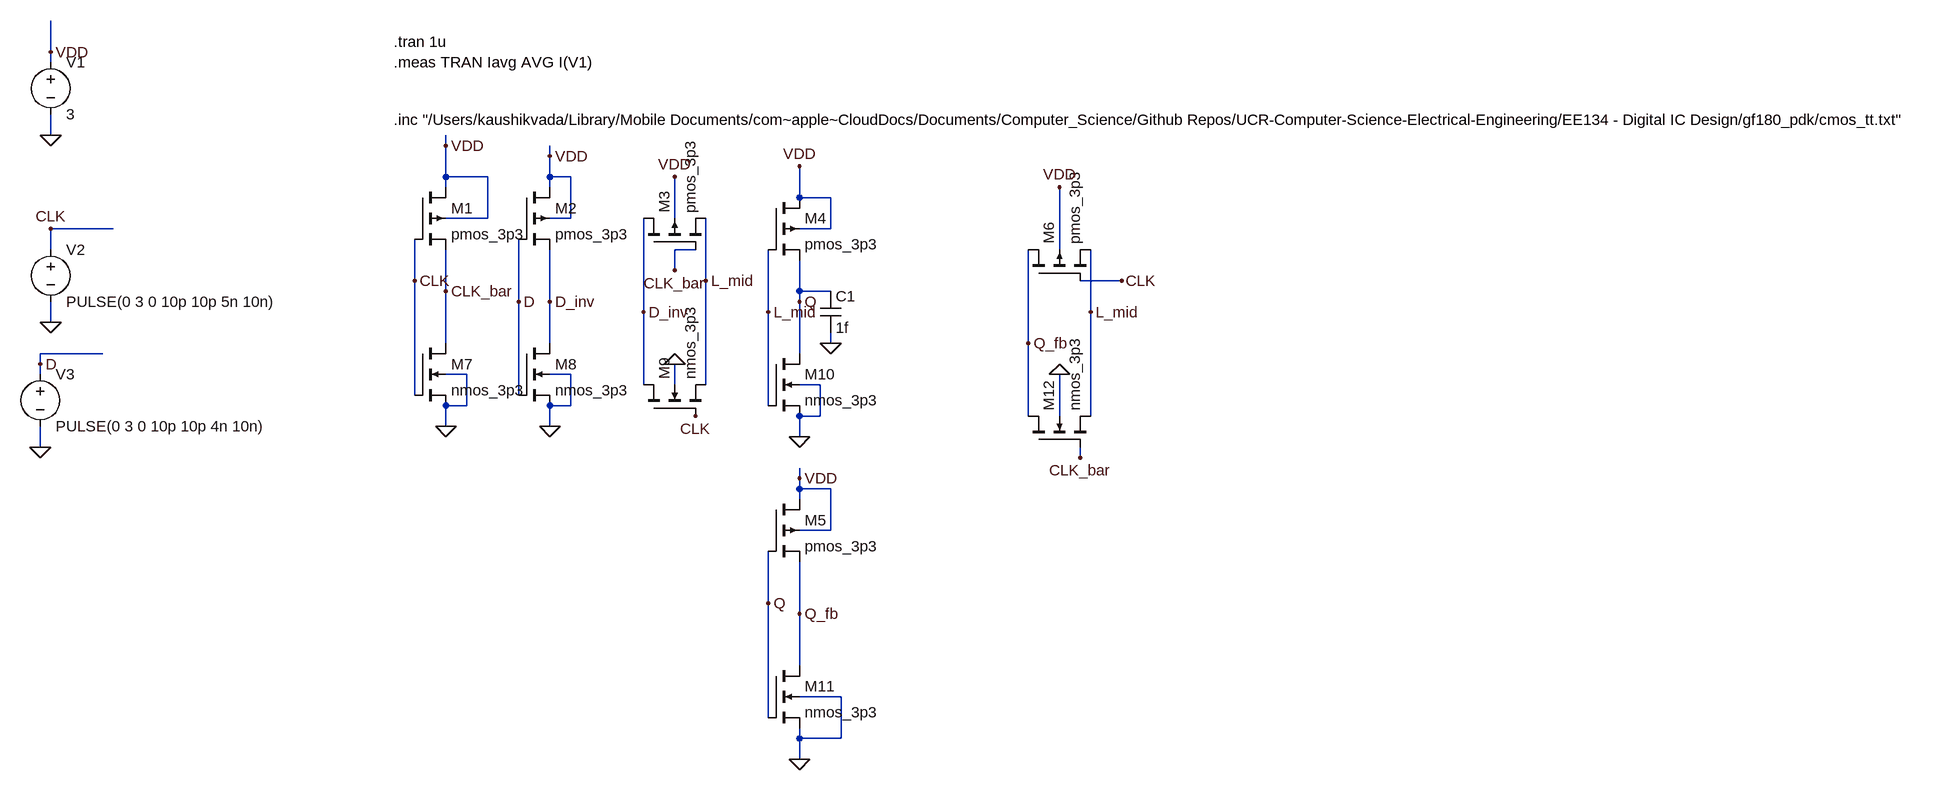
[diagram p0: schematic Q3_4.asc]
Q3_4.asc, the LTspice schematic file:
Version 4
SHEET 1 2116 992
WIRE -768 -112 -768 -160
WIRE -768 -96 -768 -112
WIRE -768 16 -768 -16
WIRE -160 32 -160 16
WIRE 0 48 0 32
WIRE -160 80 -160 32
WIRE -96 80 -160 80
WIRE 0 80 0 48
WIRE 32 80 0 80
WIRE -160 96 -160 80
WIRE 0 96 0 80
WIRE 384 112 384 64
WIRE 432 112 384 112
WIRE -96 144 -96 80
WIRE -96 144 -160 144
WIRE 32 144 32 80
WIRE 32 144 0 144
WIRE 192 144 192 80
WIRE -672 160 -768 160
WIRE 432 160 432 112
WIRE 432 160 384 160
WIRE -768 192 -768 160
WIRE 224 192 192 192
WIRE 784 192 784 96
WIRE 192 224 192 192
WIRE -208 240 -208 176
WIRE 240 240 240 144
WIRE 880 240 816 240
WIRE -160 256 -160 192
WIRE 384 256 384 208
WIRE 432 256 384 256
WIRE -48 272 -48 176
WIRE 0 272 0 192
WIRE 384 272 384 256
WIRE 144 288 144 144
WIRE 336 288 336 192
WIRE 832 288 832 192
WIRE -768 304 -768 272
WIRE -160 336 -160 256
WIRE 0 336 0 272
WIRE 432 336 432 320
WIRE 736 336 736 192
WIRE -688 352 -784 352
WIRE 384 352 384 272
WIRE -784 368 -784 352
WIRE -784 384 -784 368
WIRE -128 384 -160 384
WIRE 32 384 0 384
WIRE 144 400 144 288
WIRE 192 400 192 368
WIRE 240 400 240 240
WIRE 416 400 384 400
WIRE -208 416 -208 240
WIRE -48 416 -48 272
WIRE -128 432 -128 384
WIRE -128 432 -160 432
WIRE 32 432 32 384
WIRE 32 432 0 432
WIRE 336 432 336 288
WIRE 416 448 416 400
WIRE 416 448 384 448
WIRE 736 448 736 336
WIRE 784 448 784 384
WIRE 832 448 832 288
WIRE -160 464 -160 432
WIRE 0 464 0 432
WIRE 384 480 384 448
WIRE -784 496 -784 464
WIRE 816 512 816 496
WIRE 384 544 384 528
WIRE 384 560 384 544
WIRE 432 560 384 560
WIRE 384 576 384 560
WIRE 432 624 432 560
WIRE 432 624 384 624
WIRE 336 736 336 656
WIRE 384 752 384 672
WIRE 384 832 384 752
WIRE 448 880 384 880
WIRE 336 912 336 736
WIRE 384 944 384 928
WIRE 448 944 448 880
WIRE 448 944 384 944
WIRE 384 976 384 944
FLAG -768 16 0
FLAG -768 304 0
FLAG -784 496 0
FLAG -768 -112 VDD
FLAG -768 160 CLK
FLAG -784 368 D
FLAG -160 464 0
FLAG -160 256 CLK_bar
FLAG -208 240 CLK
FLAG -160 32 VDD
FLAG 0 48 VDD
FLAG 0 464 0
FLAG 0 272 D_inv
FLAG -48 272 D
FLAG 144 288 D_inv
FLAG 240 240 L_mid
FLAG 192 80 VDD
FLAG 192 224 CLK_bar
FLAG 224 448 CLK
FLAG 192 368 0
FLAG 384 64 VDD
FLAG 384 480 0
FLAG 336 288 L_mid
FLAG 384 272 Q
FLAG 432 336 0
FLAG 384 544 VDD
FLAG 384 976 0
FLAG 336 736 Q
FLAG 384 752 Q_fb
FLAG 736 336 Q_fb
FLAG 832 288 L_mid
FLAG 784 96 VDD
FLAG 784 384 0
FLAG 880 240 CLK
FLAG 816 512 CLK_bar
SYMBOL pmos4 -208 96 R0
SYMATTR InstName M1
SYMATTR Value pmos_3p3
SYMATTR Value2 l=1u w=8u
SYMBOL pmos4 -48 96 R0
SYMATTR InstName M2
SYMATTR Value pmos_3p3
SYMATTR Value2 l=1u w=8u
SYMBOL pmos4 144 192 R270
SYMATTR InstName M3
SYMATTR Value pmos_3p3
SYMATTR Value2 l=1u w=8u
SYMBOL pmos4 336 112 R0
SYMATTR InstName M4
SYMATTR Value pmos_3p3
SYMATTR Value2 l=1u w=8u
SYMBOL pmos4 336 576 R0
SYMATTR InstName M5
SYMATTR Value pmos_3p3
SYMATTR Value2 l=1u w=8u
SYMBOL pmos4 736 240 R270
SYMATTR InstName M6
SYMATTR Value pmos_3p3
SYMATTR Value2 l=1u w=8u
SYMBOL nmos4 -208 336 R0
SYMATTR InstName M7
SYMATTR Value nmos_3p3
SYMATTR Value2 l=1u w=4u
SYMBOL nmos4 -48 336 R0
SYMATTR InstName M8
SYMATTR Value nmos_3p3
SYMATTR Value2 l=1u w=4u
SYMBOL nmos4 144 448 R270
SYMATTR InstName M9
SYMATTR Value nmos_3p3
SYMATTR Value2 l=1u w=4u
SYMBOL nmos4 336 352 R0
SYMATTR InstName M10
SYMATTR Value nmos_3p3
SYMATTR Value2 l=1u w=4u
SYMBOL nmos4 336 832 R0
SYMATTR InstName M11
SYMATTR Value nmos_3p3
SYMATTR Value2 l=1u w=4u
SYMBOL nmos4 736 496 R270
SYMATTR InstName M12
SYMATTR Value nmos_3p3
SYMATTR Value2 l=1u w=4u
SYMBOL voltage -768 -112 R0
SYMATTR InstName V1
SYMATTR Value 3
SYMBOL voltage -768 176 R0
SYMATTR InstName V2
SYMATTR Value PULSE(0 3 0 10p 10p 5n 10n)
SYMBOL voltage -784 368 R0
SYMATTR InstName V3
SYMATTR Value PULSE(0 3 0 10p 10p 4n 10n)
SYMBOL cap 416 256 R0
SYMATTR InstName C1
SYMATTR Value 1f
TEXT -240 -8 Left 2 !.inc "/Users/kaushikvada/Library/Mobile Documents/com~apple~CloudDocs/Documents/Computer_Science/Github Repos/UCR-Computer-Science-Electrical-Engineering/EE134 - Digital IC Design/gf180_pdk/cmos_tt.txt"
TEXT -240 -128 Left 2 !.tran 1u
TEXT -240 -96 Left 2 !.meas TRAN Iavg AVG I(V1)

The netlist it stands for:
* Q3_4.asc
M1 VDD CLK CLK_bar VDD pmos_3p3 l=1u w=8u
M2 VDD D D_inv VDD pmos_3p3 l=1u w=8u
M3 D_inv CLK_bar L_mid VDD pmos_3p3 l=1u w=8u
M4 VDD L_mid Q VDD pmos_3p3 l=1u w=8u
M5 VDD Q Q_fb VDD pmos_3p3 l=1u w=8u
M6 Q_fb CLK L_mid VDD pmos_3p3 l=1u w=8u
M7 CLK_bar CLK 0 0 nmos_3p3 l=1u w=4u
M8 D_inv D 0 0 nmos_3p3 l=1u w=4u
M9 D_inv CLK L_mid 0 nmos_3p3 l=1u w=4u
M10 Q L_mid 0 0 nmos_3p3 l=1u w=4u
M11 Q_fb Q 0 0 nmos_3p3 l=1u w=4u
M12 Q_fb CLK_bar L_mid 0 nmos_3p3 l=1u w=4u
V1 VDD 0 3
V2 CLK 0 PULSE(0 3 0 10p 10p 5n 10n)
V3 D 0 PULSE(0 3 0 10p 10p 4n 10n)
C1 Q 0 1f
.model NMOS NMOS
.model PMOS PMOS
.lib standard.mos
.inc "/Users/kaushikvada/Library/Mobile Documents/com~apple~CloudDocs/Documents/Computer_Science/Github Repos/UCR-Computer-Science-Electrical-Engineering/EE134 - Digital IC Design/gf180_pdk/cmos_tt.txt"
.tran 1u
.meas TRAN Iavg AVG I(V1)
.backanno
.end